# EAGLE design BPU_display-v1d-28inch (EAGLE 9.5.1)
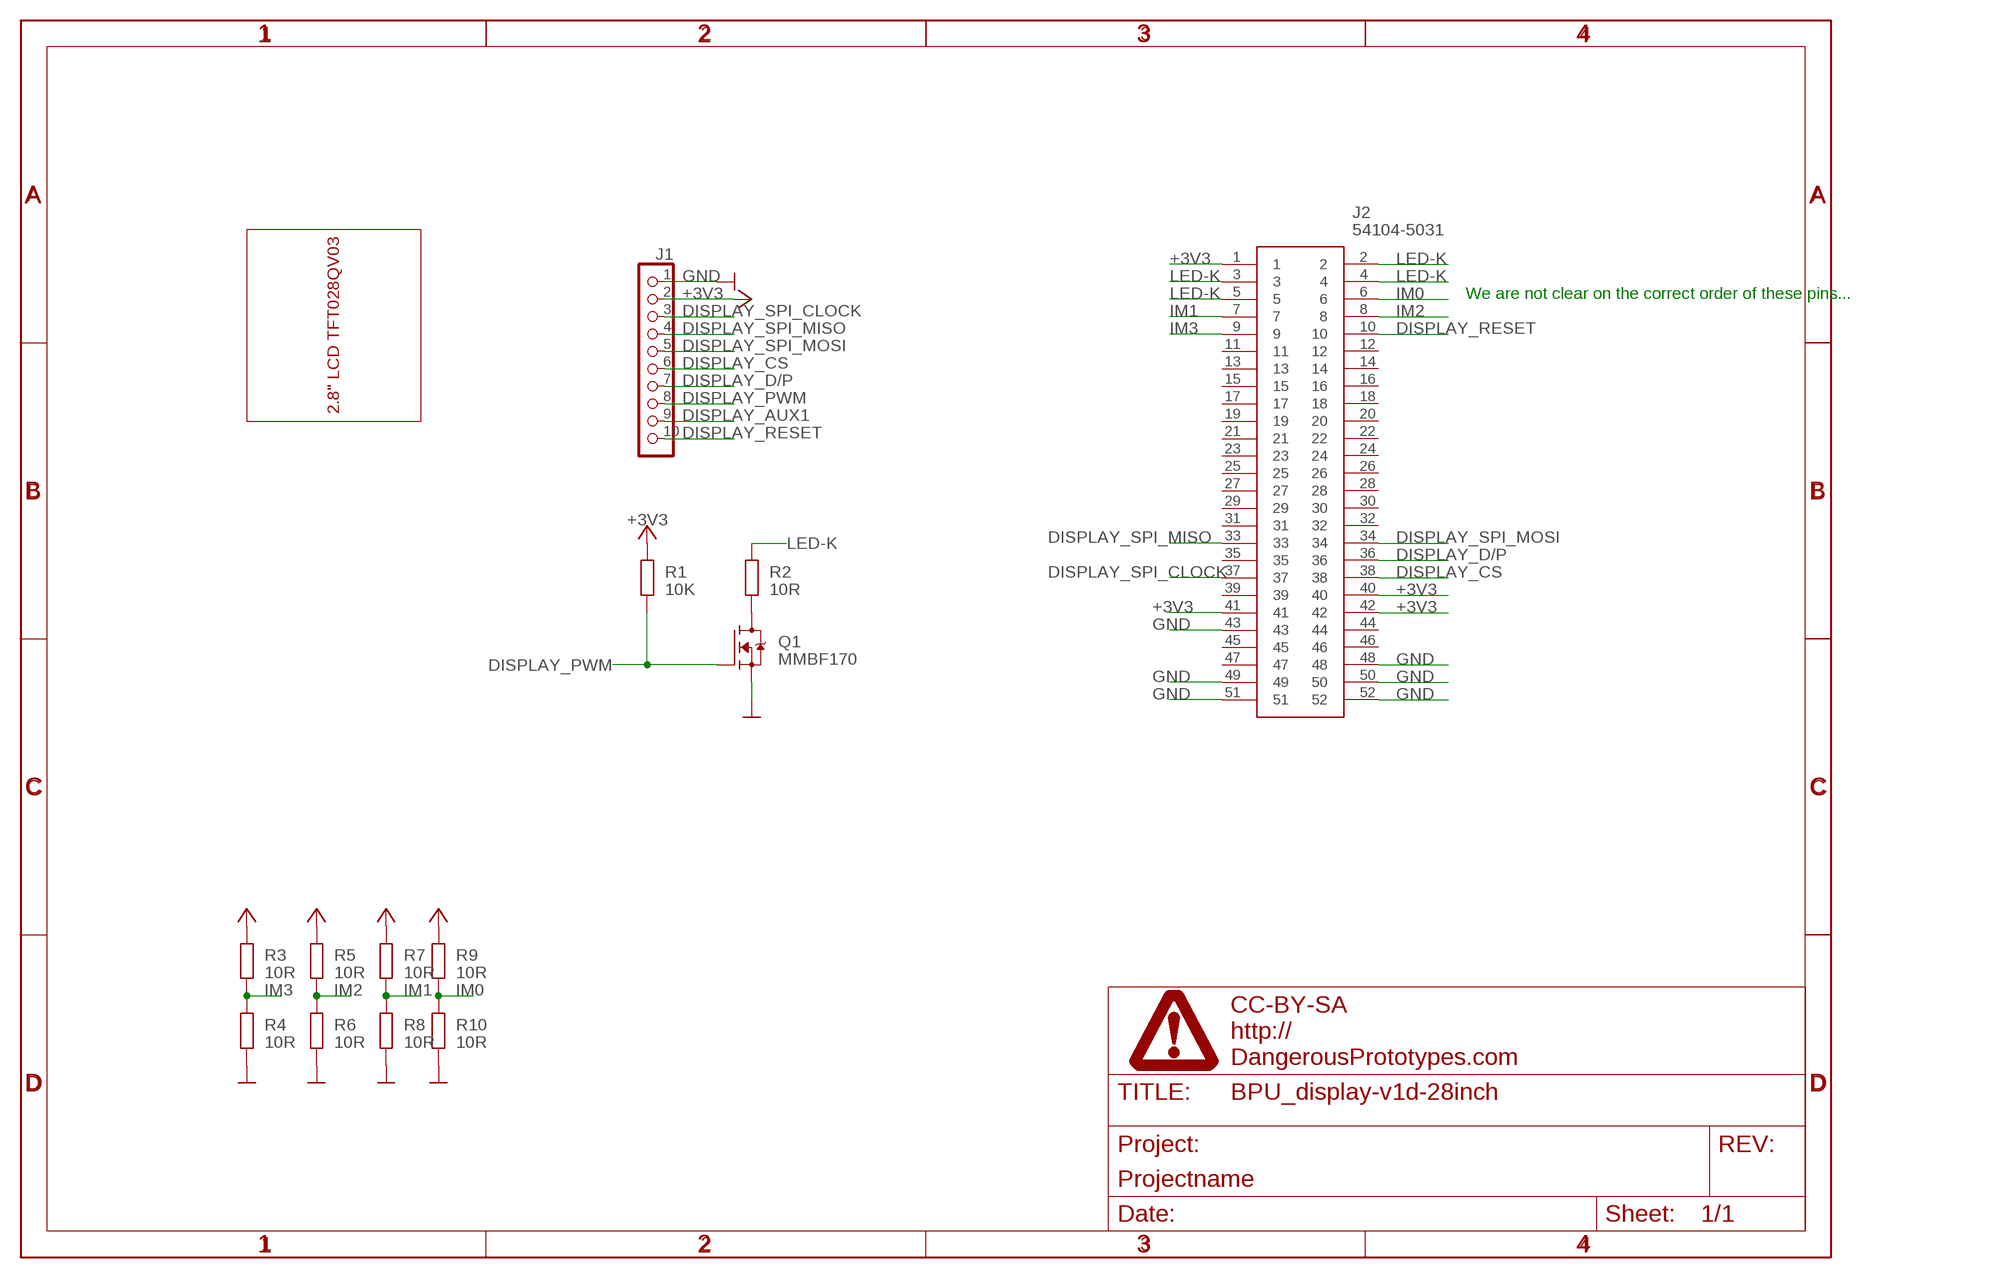
[diagram p0: schematic, sheet 1]

## Parts
J1  CON-FPC_X05B20L10T  [X05B20L10T]
J2  54104-5031  [541045031]
PAGE1  FRAME_DINA4_L  [DP_LOGO]
Q1  MMBF170  TRANSISTOR_FET_BS170-SOT-23  [SOT-23]
R1  10K  R-EU_R0603  [R0603]
R2  10R  R-EU_R0603  [R0603]
R3  10R  R-EU_R0603  [R0603]
R4  10R  R-EU_R0603  [R0603]
R5  10R  R-EU_R0603  [R0603]
R6  10R  R-EU_R0603  [R0603]
R7  10R  R-EU_R0603  [R0603]
R8  10R  R-EU_R0603  [R0603]
R9  10R  R-EU_R0603  [R0603]
R10  10R  R-EU_R0603  [R0603]
U$1  LCDS  [2.8INCHLCD]

## Nets
+3V3: J1.2 J2.1 J2.40 J2.41 J2.42 R1.2 R3.2 R5.2 R7.2 R9.2 ; supply symbol labelled SUPPLY_+3V3
DISPLAY_AUX1: J1.9
DISPLAY_CS: J1.6 J2.38
DISPLAY_D/P: J1.7 J2.36
DISPLAY_PWM: J1.8 Q1.1(G) R1.1
DISPLAY_RESET [signal_digital]: J1.10 J2.10
DISPLAY_SPI_CLOCK: J1.3 J2.37
DISPLAY_SPI_MISO: J1.4 J2.33
DISPLAY_SPI_MOSI: J1.5 J2.34
GND: J1.1 J2.43 J2.48 J2.49 J2.50 J2.51 J2.52 Q1.2(S) R4.1 R6.1 R8.1 R10.1 ; supply symbol labelled SUPPLY_GND
IM0: J2.6 R9.1 R10.2
IM1: J2.7 R7.1 R8.2
IM2: J2.8 R5.1 R6.2
IM3: J2.9 R3.1 R4.2
LED-K: J2.2 J2.3 J2.4 J2.5 R2.2
N$2: Q1.3(D) R2.1
Unconnected: J2.11 J2.12 J2.13 J2.14 J2.15 J2.16 J2.17 J2.18 J2.19 J2.20 J2.21 J2.22 J2.23 J2.24 J2.25 J2.26 J2.27 J2.28 J2.29 J2.30 J2.31 J2.32 J2.35 J2.39 J2.44 J2.45 J2.46 J2.47

## Notes on the sheet
- We are not clear on the correct order of these pins...

## Library data of the parts
J1 = dp_devices.v6:CON-FPC_X05B20L10T: 10-pin 0.5mm pitch SMD FPC Connector X05B20L10T
J2 = SamacSys_Parts:54104-5031: Connector 0.5mm, FFC/FPC, SMT,r/a,50w,Au Molex FFC/FPC SMT Series 0.5mm Pitch 50 Way Right Angle SMT Female FPC Connector, ZIF Top Contact Source: Datasheet <https://componentsearchengine.com/Datasheets/1/54104-5031.pdf>; DESCRIPTION: Connector 0.5mm, FFC/FPC, SMT,r/a,50w,Au Molex FFC/FPC SMT Series 0.5mm Pitch 50 Way Right Angle SMT Female FPC Connector, ZIF Top Contact; HEIGHT: 2mm; MANUFACTURER_NAME: Molex; MANUFACTURER_PART_NUMBER: 54104-5031; MOUSER_PART_NUMBER: 538-54104-5031; MOUSER_PRICE-STOCK: https://www.mouser.com/Search/Refine.aspx?Keyword=538-54104-5031
PAGE1 = dp_devices.v6:FRAME_DINA4_L: A4 DP frame Standard Dangerous Prototypes schematic frame. Automagically adds the DP logo and standard texts to the PCB Use the atrribute in the schematic editor to change the fields.; FF1: fulfillment by; FF2: Seeed Studio; FF3: www.seeedstudio.com; LICENSE: CC-BY-SA; PROJECT: Projectname; URL1: http://; URL2: DangerousPrototypes.com
Q1 = dp_devices.v6:TRANSISTOR_FET_BS170: N-Channel Enhancement Mode Field Effect Transistor
R1-R10 = rcl:R-EU_: RESISTOR, European symbol; SPICEPREFIX: R
U$1 = LCD:LCDS

## Net classes
1 power: width 0.305 mm
3 signal_digital: width 0.254 mm

## Board
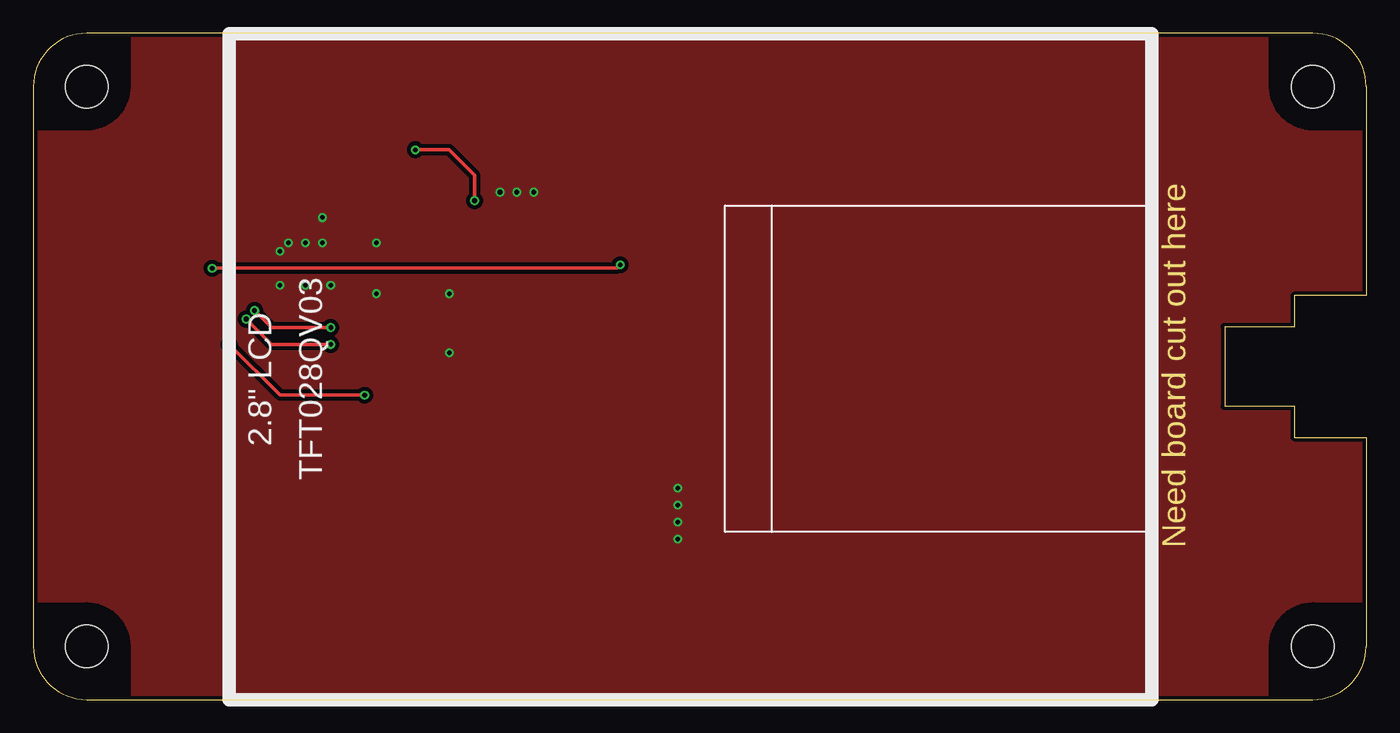
[diagram p1: board, top side]
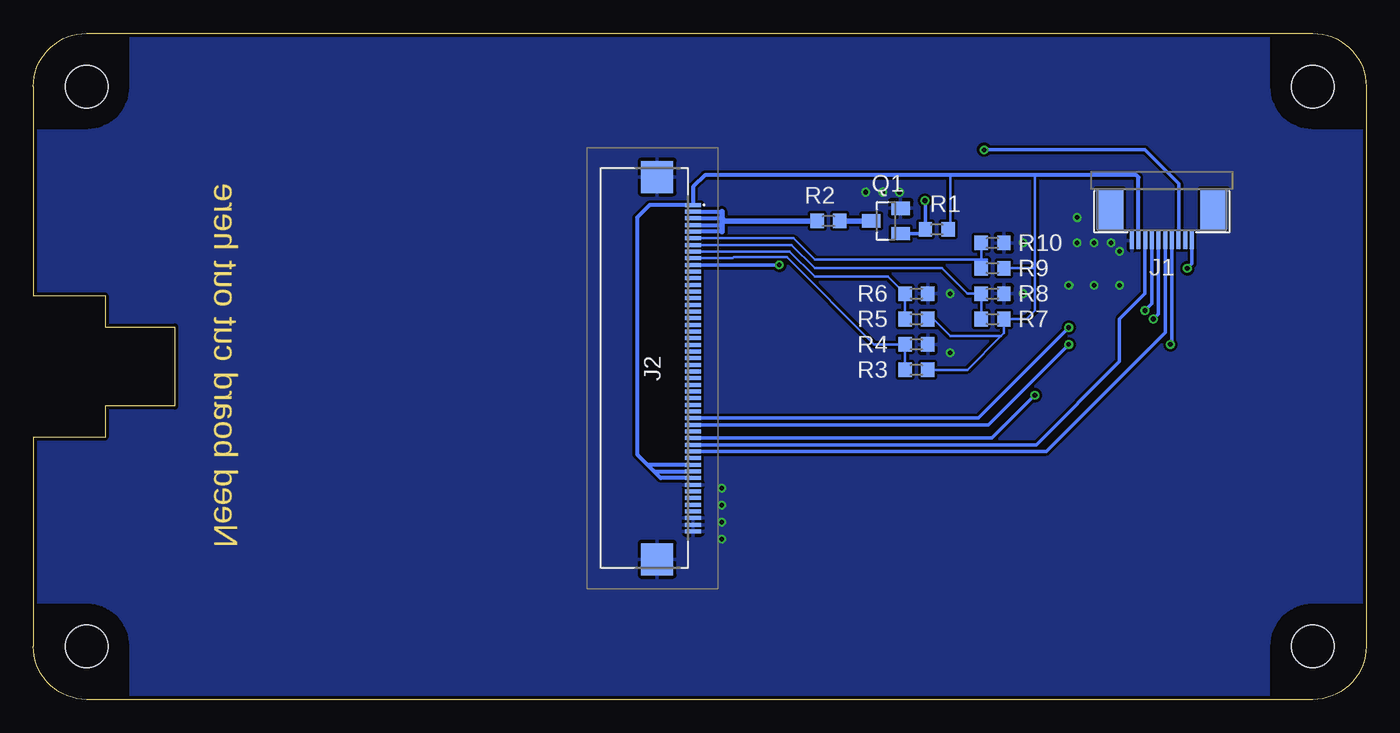
[diagram p2: board, bottom side, seen from below]

Size 100 x 50 mm. Coordinates in mm from the lower left corner, seen from the top.
Outline: 99.99,46 99.99,30.31 94.61,30.31 94.61,27.98 89.38,27.98 89.38,22.02 94.61,22.02 94.61,19.69 99.99,19.69 99.99,4
Outline: 100,46 arc90 96,50 4,50 arc90 0,46 0,4 arc90 4,0 96,0 arc90 100,4
Copper layers (1*16): Top 0.035mm / dielectric 1.5mm / Bottom 0.035mm
Design rules "dirt_cheap_dirty_boards.v1.1": minimum track width 6mil, minimum drill 12mil, track to track 6mil, track to pad 6mil, pad to pad 6mil, via to via 6mil, smd to smd 0mil, copper to edge 10mil, drill to drill 10mil, minimum pad ring 10mil, minimum via ring 6mil, stop-mask expansion 2mil, vias tented up to drill 25mil, thermal gap 10mil
Holes 3.2 mm at 4,4 96,4 96,46 4,46
tKeepout: 8 lines
bKeepout: 8 lines
tRestrict: area 0,43 to 7,50; area 93,43 to 100,50; area 0,0 to 7,7; area 93,0 to 100,7
bRestrict: area 0,43 to 7,50; area 93,43 to 100,50; area 0,0 to 7,7; area 93,0 to 100,7
vRestrict: area 113.9,82.8 to 120.9,89.8; area 206.9,82.8 to 213.9,89.8; area 113.9,39.8 to 120.9,46.8; area 206.9,39.8 to 213.9,46.8

### Footprints (pad centres in the part's own frame; a part is rotated, then mirrored left to right if it is on the bottom)
X05B20L10T = smd 0.3 x 1.3: 1 2.25,2.35; 2 1.75,2.35; 3 1.25,2.35; 4 0.75,2.35; 5 0.25,2.35; 6 -0.25,2.35; 7 -0.75,2.35; 8 -1.25,2.35; 9 -1.75,2.35; 10 -2.25,2.35 | smd 2 x 3: 11 -3.9,0; 12 3.9,0
541045031 = smd 0.3 x 1.2: 1 -12.25,0.4; 2 -11.75,0.4; 3 -11.25,0.4; 4 -10.75,0.4; 5 -10.25,0.4; 6 -9.75,0.4; 7 -9.25,0.4; 8 -8.75,0.4; 9 -8.25,0.4; 10 -7.75,0.4; 11 -7.25,0.4; 12 -6.75,0.4; 13 -6.25,0.4; 14 -5.75,0.4; 15 -5.25,0.4; 16 -4.75,0.4; 17 -4.25,0.4; 18 -3.75,0.4; 19 -3.25,0.4; 20 -2.75,0.4; 21 -2.25,0.4; 22 -1.75,0.4; 23 -1.25,0.4; 24 -0.75,0.4; 25 -0.25,0.4; 26 0.25,0.4; 27 0.75,0.4; 28 1.25,0.4; 29 1.75,0.4; 30 2.25,0.4; 31 2.75,0.4; 32 3.25,0.4; 33 3.75,0.4; 34 4.25,0.4; 35 4.75,0.4; 36 5.25,0.4; 37 5.75,0.4; 38 6.25,0.4; 39 6.75,0.4; 40 7.25,0.4; 41 7.75,0.4; 42 8.25,0.4; 43 8.75,0.4; 44 9.25,0.4; 45 9.75,0.4; 46 10.25,0.4; 47 10.75,0.4; 48 11.25,0.4; 49 11.75,0.4; 50 12.25,0.4 | smd 2.4 x 2.4: 51 -14.35,-2.3; 52 14.35,-2.3
SOT-23 = smd 1 x 1.4: 1 -0.95,-1.1; 2 0.95,-1.1; 3 0,1.1
R0603 = smd 1 x 1.1: 1 -0.85,0; 2 0.85,0

### Placement (x,y rotation side)
J1  15.33,36.81 180 bottom
J2  50.89,24.87 270 bottom
PAGE1  36.66,0.24 0 top
Q1  36.03,35.92 90 bottom
R1  32.22,35.29 0 bottom
R2  40.35,35.92 180 bottom
R3  33.74,24.75 0 bottom
R4  33.74,26.65 180 bottom
R5  33.74,28.56 0 bottom
R6  33.74,30.46 180 bottom
R7  28.03,28.56 0 bottom
R8  28.03,30.46 180 bottom
R9  28.03,32.37 0 bottom
R10  28.03,34.27 180 bottom
U$1  83.91,-0.02 90 top

### Tracks (layer width: path | path; a pad name or v marks a point on that pad's centre or on a via)
+3V3
  Bottom 0.203: R1.2 31.2,35.45 31.2,39.35 | 24.85,39.35 24.85,32.37 | 24.85,32.37 24.85,29.19 25.49,28.56 R7.2 27.18,27.5 27.39,27.29 | R9.2 24.85,32.37 | 27.39,27.29 31.2,27.29 32.47,28.56 R5.2 | R3.2 29.93,24.75 27.39,27.29
  Bottom 0.305: J1.2 17.08,39.2 17.23,39.35 24.85,39.35 31.2,39.35 49.62,39.35 50.49,38.48 J2.1 53.75,37.12 54.7,36.18 54.7,18.4 53.93,17.62 | 53.43,17.12 J2.41 | 53.93,17.62 53.43,17.12 | J2.40 53.93,17.62 | J2.42 52.93,16.62 53.43,17.12
DISPLAY_CS
  Bottom 0.254: J1.6 15.08,27.54 23.99,18.62 J2.38
DISPLAY_D/P  (via drill 0.35)
  Top 0.254: v24.85,22.84 18.5,22.84 v14.69,26.65
  Bottom 0.254: J1.7 14.58,26.77 v14.69,26.65 | J2.36 28.07,19.62 v24.85,22.84
DISPLAY_PWM  (via drill 0.35)
  Top 0.254: v33.11,37.45 33.11,39.35 31.2,41.26 v28.66,41.26
  Bottom 0.254: Q1.1 33.38,34.97 R1.1 33.07,37.41 v33.11,37.45 | v28.66,41.26 16.6,41.26 14.06,38.72 14.06,34.48 J1.8
DISPLAY_RESET  (via drill 0.35)
  Top 0.254: v44.03,32.62 43.78,32.37 v13.42,32.37
  Bottom 0.254: J1.10 13.08,32.71 v13.42,32.37 | J2.10 v44.03,32.62
DISPLAY_SPI_CLOCK
  Bottom 0.254: J1.3 16.6,34.44 16.6,30.46 18.5,28.56 18.5,25.38 24.76,19.12 J2.37
DISPLAY_SPI_MISO  (via drill 0.35)
  Top 0.254: v22.31,27.92 17.87,27.92 v16.6,29.19
  Bottom 0.254: J2.33 29.11,21.12 v22.31,27.92 | J1.4 16.08,29.71 v16.6,29.19
DISPLAY_SPI_MOSI  (via drill 0.35)
  Top 0.254: v22.31,26.65 17.87,26.65 v15.96,28.56
  Bottom 0.254: v15.96,28.56 15.58,28.94 J1.5 | J2.34 28.34,20.62 v22.31,26.65
GND  (via drill 0.35)
  Bottom 0.203: v19.14,34.27 18.95,34.46
  other vias: 20.41,34.27 18.5,31.1 21.68,34.27 18.5,33.64 21.68,36.18 20.41,31.1 22.31,31.1 25.74,30.46 25.74,34.27 31.2,30.46 31.2,26.02 35.01,38.08 36.28,38.08 37.55,38.08 48.35,15.86 48.35,14.59 48.35,13.32 48.35,12.05
  pour Top (isolate 0.305, rank 6): -0.32,50.25 99.99,50.25 99.99,-0.26 -0.32,-0.26
  pour Bottom (isolate 0.203, rank 6): -0.32,50.25 99.99,50.25 99.99,-0.26 -0.32,-0.26
IM0
  Bottom 0.203: J2.6 42.99,34.62 41.36,33 28.45,33 R9.1 R10.2
IM1
  Bottom 0.203: J2.7 43.12,34.12 41.36,32.37 31.84,32.37 29.93,30.46 R8.2 R7.1
IM2
  Bottom 0.203: J2.8 43.26,33.62 41.36,31.73 35.86,31.73 R6.2 R5.1
IM3
  Bottom 0.203: J2.9 47.52,33.12 47.45,33.2 43.47,33.2 36.92,26.65 R4.2 R3.1
LED-K
  Bottom 0.305: J2.2 48.35,36.62 | J2.3 48.35,36.12 | J2.4 48.34,35.62 | 48.32,35.12 J2.5
  Bottom 0.406: R2.2 48.15,35.92 48.34,36.12 | 48.32,35.12 48.32,35.61 48.34,35.62 48.34,36.12 | 48.34,36.12 48.35,36.12 48.35,36.62
N$2
  Bottom 0.406: Q1.3 R2.1

### Text on the board
Dimension: Need board cut out here
Measures: 100mm | 50mm | 4.0mm | D = 3.2mm | R = 4.0mm
Reference: Center | Center